# EAGLE design OpenExtruderPCB (EAGLE 9.5.2)
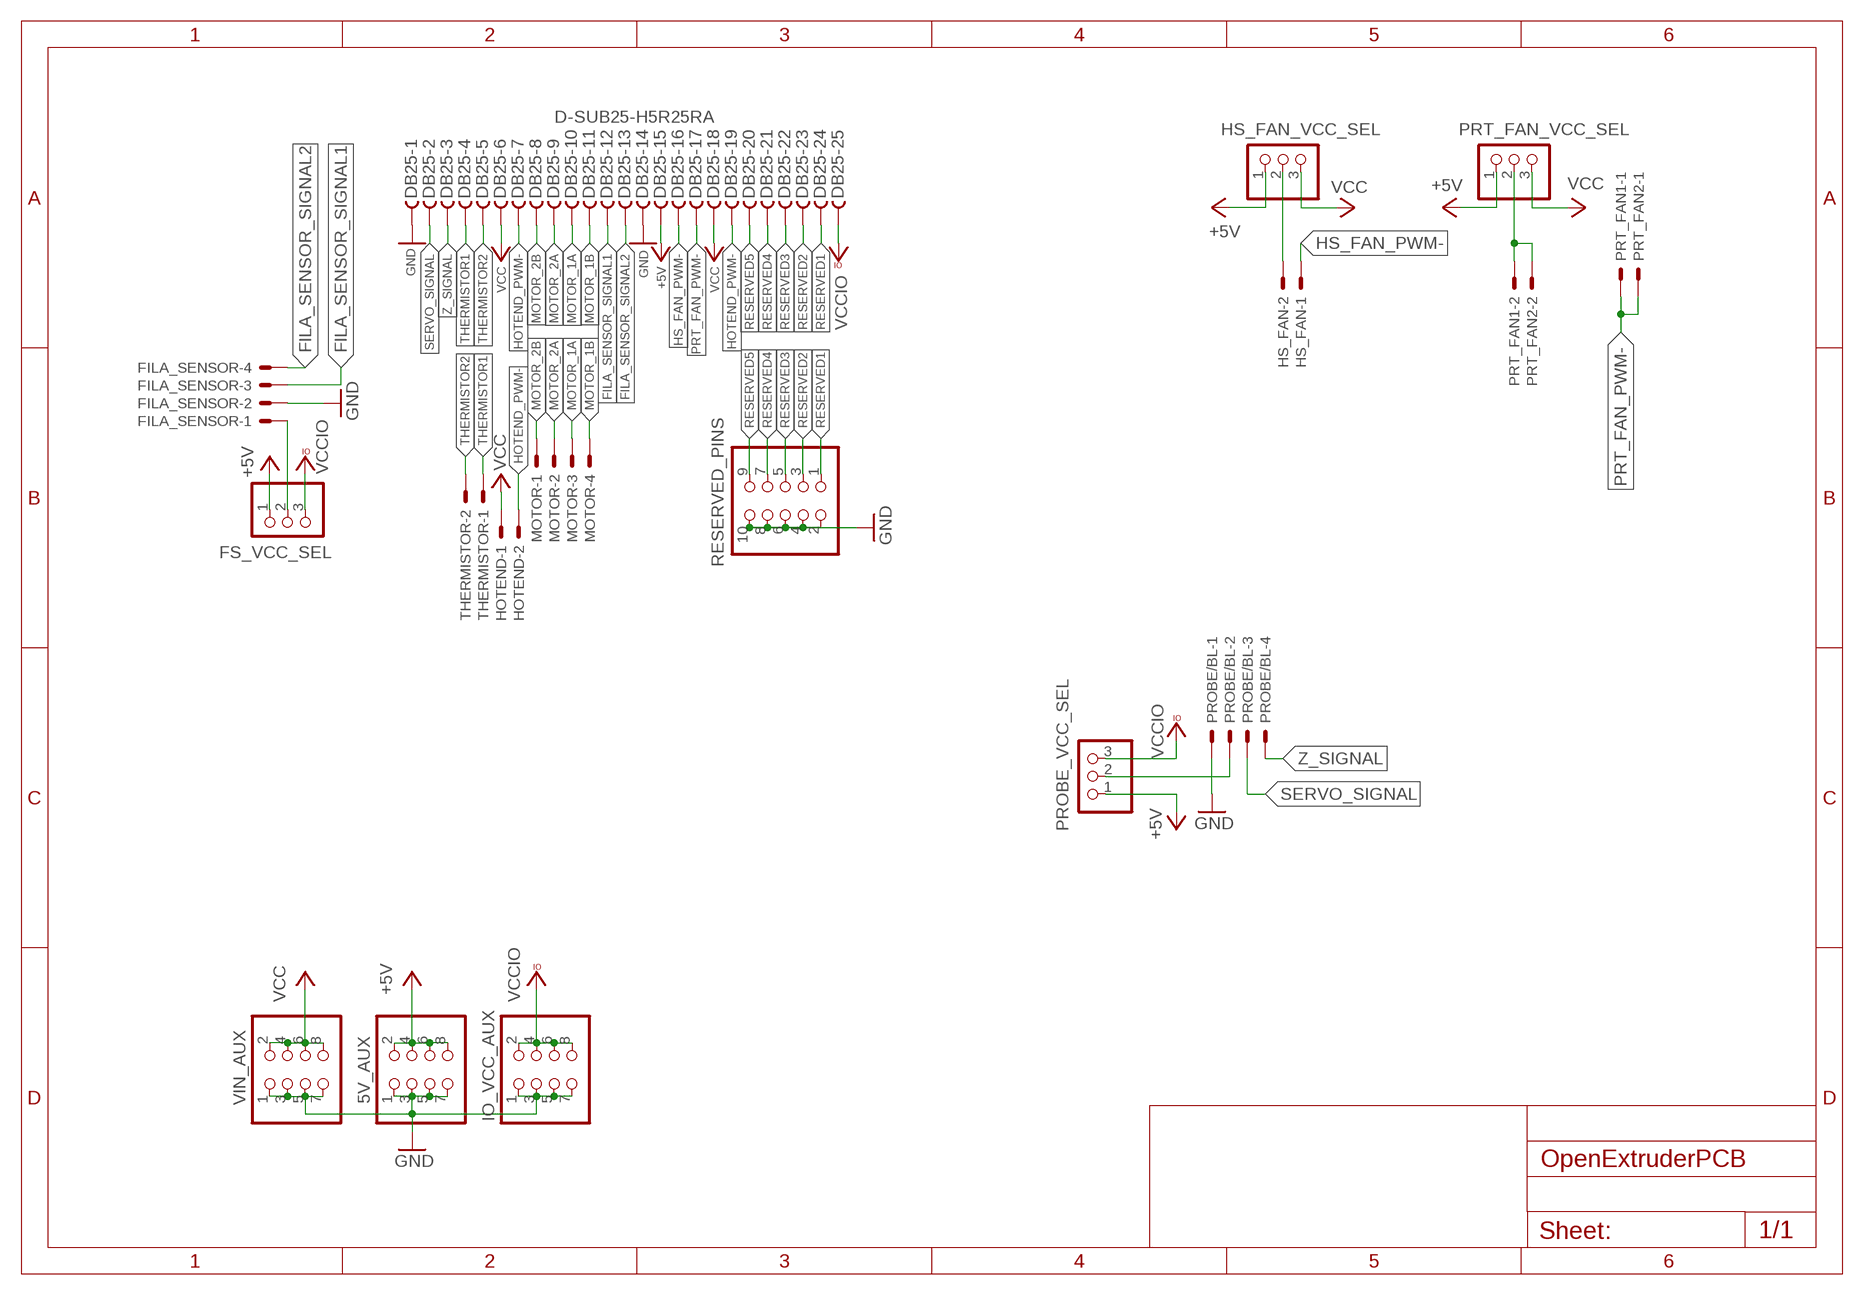
[diagram p0: schematic, sheet 1]

## Parts
5V_AUX  PINHD-2X4M  [2X04M]
DB25  D-SUB25-H5R25RA  [H5R25RA]
FILA_SENSOR  JST-XH-04-PIN-ROUND-PAD  [JST-XH-04-PACKAGE-ROUND-PAD]
FS_VCC_SEL  PINHD-1X3  [1X03]
HOTEND  JST-XH-02-PIN-LONG-PAD  [JST-XH-02-PACKAGE-LONG-PAD]
HS_FAN  JST-XH-02-PIN-ROUND-PAD  [JST-XH-02-PACKAGE-ROUND-PAD]
HS_FAN_VCC_SEL  PINHD-1X3  [1X03]
IO_VCC_AUX  PINHD-2X4M  [2X04M]
MOTOR  JST-XH-04-PIN-LONG-PAD  [JST-XH-04-PACKAGE-LONG-PAD]
PROBE/BL  JST-XH-04-PIN-ROUND-PAD  [JST-XH-04-PACKAGE-ROUND-PAD]
PROBE_VCC_SEL  PINHD-1X3  [1X03]
PRT_FAN1  JST-XH-02-PIN-ROUND-PAD  [JST-XH-02-PACKAGE-ROUND-PAD]
PRT_FAN2  JST-XH-02-PIN-ROUND-PAD  [JST-XH-02-PACKAGE-ROUND-PAD]
PRT_FAN_VCC_SEL  PINHD-1X3  [1X03]
RESERVED_PINS  PINHD-2X5M  [2X05M]
THERMISTOR  JST-XH-02-PIN-ROUND-PAD  [JST-XH-02-PACKAGE-ROUND-PAD]
VIN_AUX  PINHD-2X4M  [2X04M]

## Nets
+5V: 5V_AUX.2 5V_AUX.4 5V_AUX.6 5V_AUX.8 DB25.15 FS_VCC_SEL.1 HS_FAN_VCC_SEL.1 PROBE_VCC_SEL.1 PRT_FAN_VCC_SEL.1
FILA_SENSOR_SIGNAL1: DB25.12 FILA_SENSOR.3
FILA_SENSOR_SIGNAL2: DB25.13 FILA_SENSOR.4
FS_VCC: FILA_SENSOR.1 FS_VCC_SEL.2
GND: 5V_AUX.1 5V_AUX.3 5V_AUX.5 5V_AUX.7 DB25.1 DB25.14 FILA_SENSOR.2 IO_VCC_AUX.1 IO_VCC_AUX.3 IO_VCC_AUX.5 IO_VCC_AUX.7 PROBE/BL.1 RESERVED_PINS.2 RESERVED_PINS.4 RESERVED_PINS.6 RESERVED_PINS.8 RESERVED_PINS.10 VIN_AUX.1 VIN_AUX.3 VIN_AUX.5 VIN_AUX.7
HOTEND_PWM-: DB25.7 DB25.19 HOTEND.2
HS_FAN_PWM-: DB25.16 HS_FAN.1
HS_FAN_VCC: HS_FAN.2 HS_FAN_VCC_SEL.2
MOTOR_1A: DB25.10 MOTOR.3
MOTOR_1B: DB25.11 MOTOR.4
MOTOR_2A: DB25.9 MOTOR.2
MOTOR_2B: DB25.8 MOTOR.1
PROBE_VCC: PROBE/BL.2 PROBE_VCC_SEL.2
PRT_FAN_PWM-: DB25.17 PRT_FAN1.1 PRT_FAN2.1
PRT_FAN_VCC: PRT_FAN1.2 PRT_FAN2.2 PRT_FAN_VCC_SEL.2
RESERVED1: DB25.24 RESERVED_PINS.1
RESERVED2: DB25.23 RESERVED_PINS.3
RESERVED3: DB25.22 RESERVED_PINS.5
RESERVED4: DB25.21 RESERVED_PINS.7
RESERVED5: DB25.20 RESERVED_PINS.9
SERVO_SIGNAL: DB25.2 PROBE/BL.3
THERMISTOR1: DB25.4 THERMISTOR.1
THERMISTOR2: DB25.5 THERMISTOR.2
VCC: DB25.6 DB25.18 HOTEND.1 HS_FAN_VCC_SEL.3 PRT_FAN_VCC_SEL.3 VIN_AUX.2 VIN_AUX.4 VIN_AUX.6 VIN_AUX.8
VCCIO: DB25.25 FS_VCC_SEL.3 IO_VCC_AUX.2 IO_VCC_AUX.4 IO_VCC_AUX.6 IO_VCC_AUX.8 PROBE_VCC_SEL.3
Z_SIGNAL: DB25.3 PROBE/BL.4

## Library data of the parts
5V_AUX IO_VCC_AUX VIN_AUX = pinhead:PINHD-2X4: PIN HEADER
DB25 = con-thomas-betts:D-SUB25-: D-Subminiatur Connector Source: Electronioc Interconnects European Edition 1998; MPN: H5R25RA29CS; OC_FARNELL: unknown; OC_NEWARK: 93F8340
FILA_SENSOR MOTOR PROBE/BL = Rembrandt Electronics - JST XH Connectors v1-0:JST-XH-04-PIN: JST XH Connector 2 Pin Wire to board connector. Pitch: 2,54 mm, (0.100") Number of pins: 4 Created by Rembrandt Electronics www.rembrandtelectronics.com
FS_VCC_SEL HS_FAN_VCC_SEL PROBE_VCC_SEL PRT_FAN_VCC_SEL = pinhead:PINHD-1X3: PIN HEADER
HOTEND HS_FAN PRT_FAN1 PRT_FAN2 THERMISTOR = Rembrandt Electronics - JST XH Connectors v1-0:JST-XH-02-PIN: JST XH Connector 2 Pin Wire to board connector. Pitch: 2,54 mm, (0.100") Number of pins: 2 Created by Rembrandt Electronics www.rembrandtelectronics.com
RESERVED_PINS = pinhead:PINHD-2X5: PIN HEADER

## Board
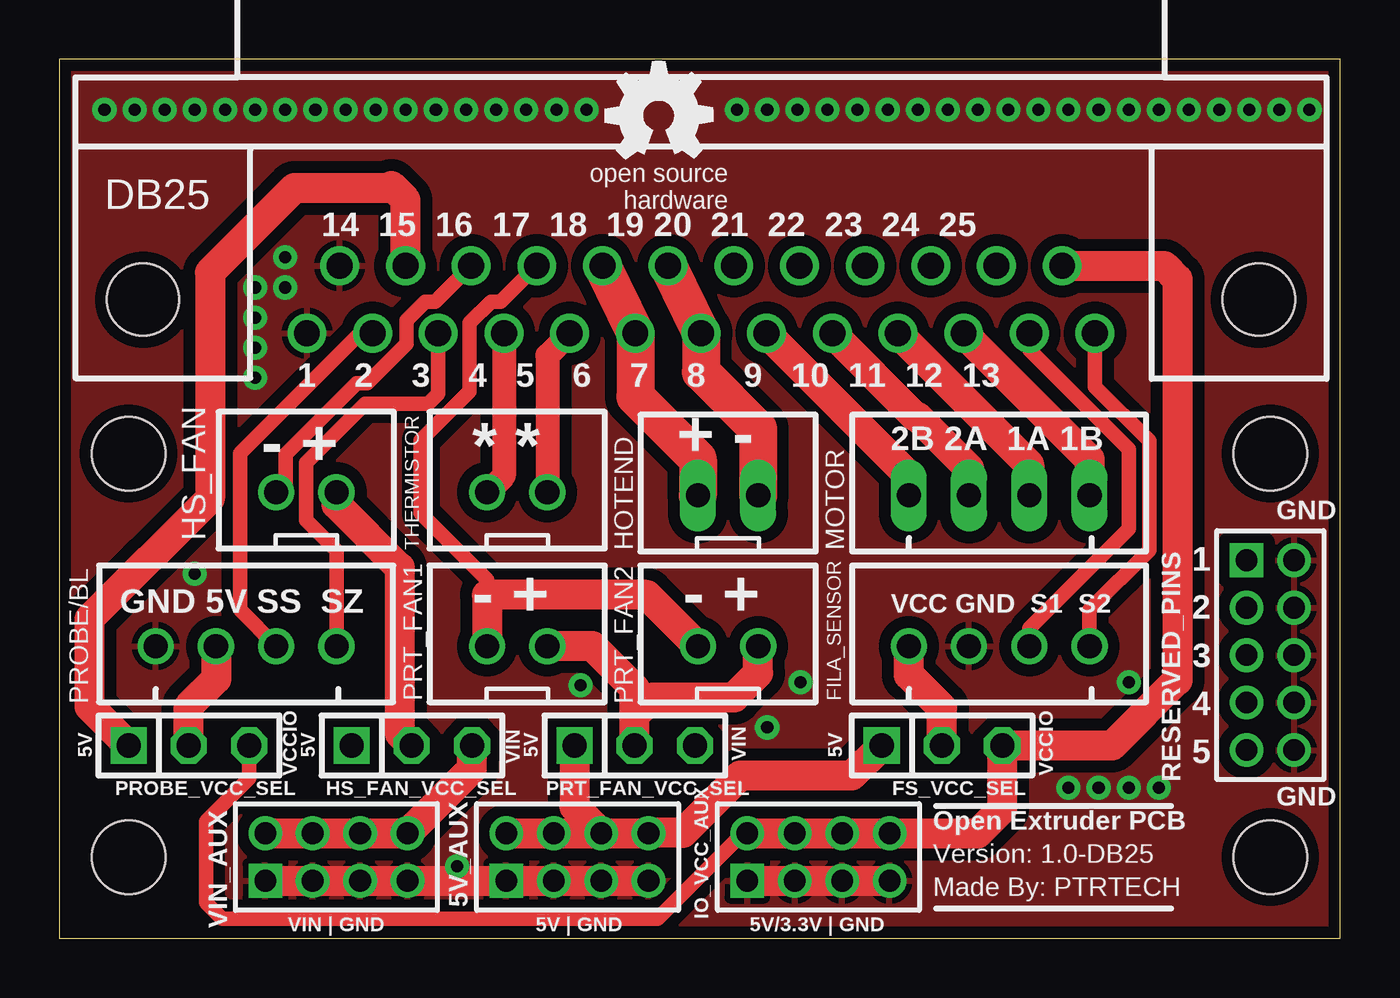
[diagram p1: board, top side]
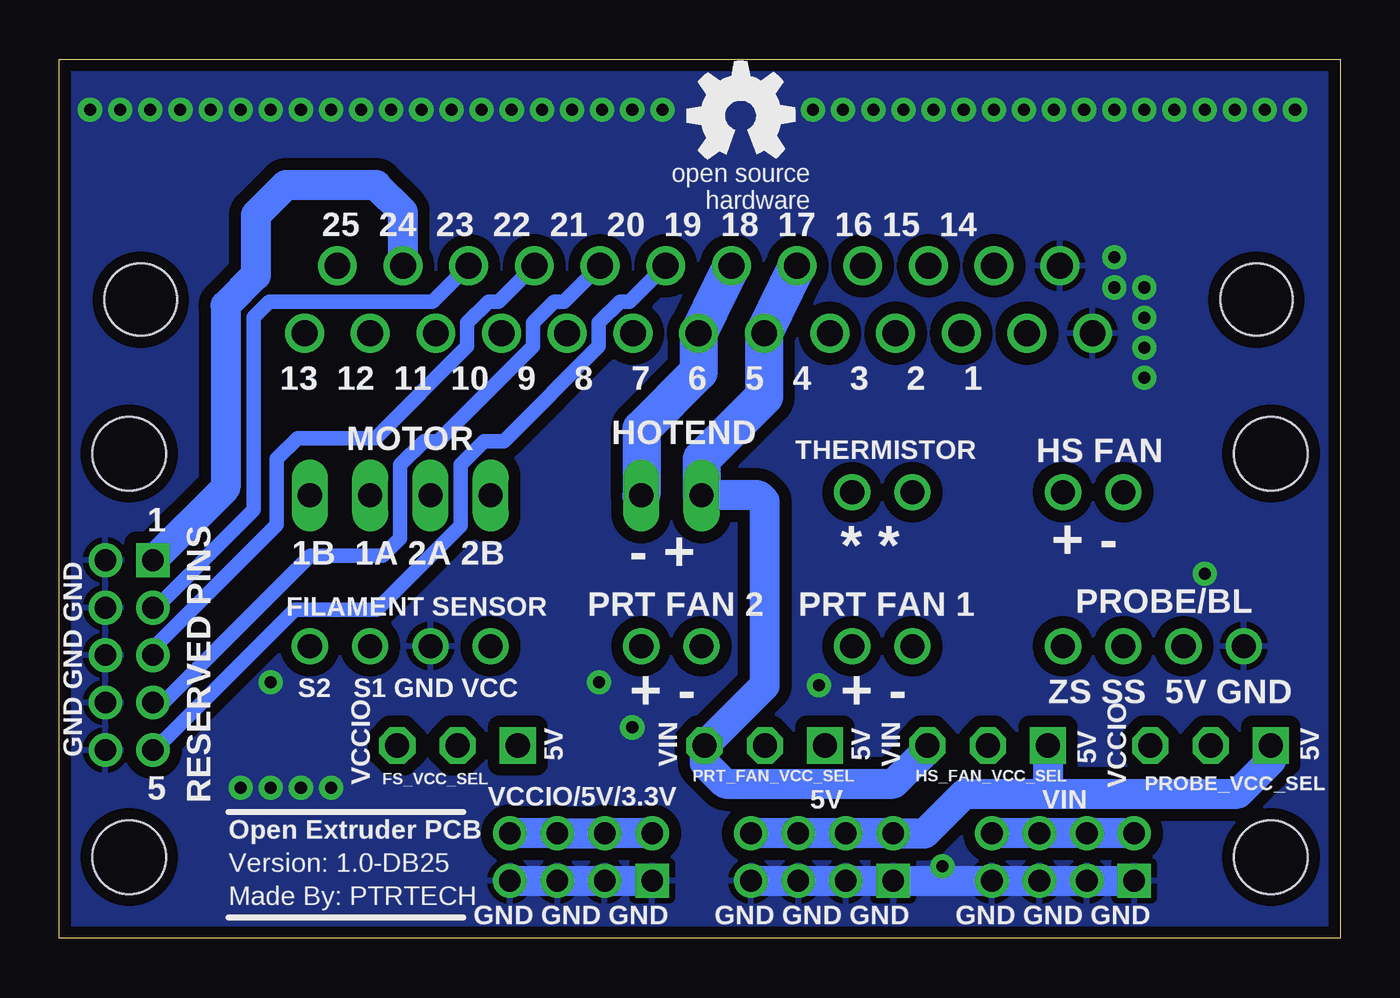
[diagram p2: board, bottom side, seen from below]

Size 54 x 37.05 mm. Coordinates in mm from the lower left corner, seen from the top.
Outline: 0,0 54,0 54,37.05 0,37.05 0,0
Copper layers (1*16): Top 0.035mm / dielectric 1.5mm / Bottom 0.035mm
Design rules "SparkFun-2-layer-STANDARD": minimum track width 10mil, minimum drill 20mil, track to track 10mil, track to pad 8mil, pad to pad 8mil, via to via 10mil, smd to smd 8mil, copper to edge 8mil, drill to drill 8mil, minimum pad ring 10mil, minimum via ring 10mil, stop-mask expansion 4mil, vias tented up to drill 25mil, thermal gap 10mil
Holes 3.1 mm at 2.92,20.43 2.92,3.43 51.05,3.43 51.05,20.43

### Footprints (pad centres in the part's own frame; a part is rotated, then mirrored left to right if it is on the bottom)
2X04M = drill 0.914 square: 1 -3,-1 | drill 0.914: 2 -3,1; 3 -1,-1; 4 -1,1; 5 1,-1; 6 1,1; 7 3,-1; 8 3,1
H5R25RA = drill 1.092: 1 16.612,1.422; 2 13.843,1.422; 3 11.074,1.422; 4 8.306,1.422; 5 5.537,1.422; 6 2.769,1.422; 7 0,1.422; 8 -2.769,1.422; 9 -5.537,1.422; 10 -8.306,1.422; 11 -11.074,1.422; 12 -13.843,1.422; 13 -16.612,1.422; 14 15.227,-1.422; 15 12.459,-1.422; 16 9.69,-1.422; 17 6.921,-1.422; 18 4.153,-1.422; 19 1.384,-1.422; 20 -1.384,-1.422; 21 -4.153,-1.422; 22 -6.921,-1.422; 23 -9.69,-1.422; 24 -12.459,-1.422; 25 -15.227,-1.422 | hole 3.048: -23.52,0; 23.52,0
JST-XH-04-PACKAGE-ROUND-PAD = drill 1.016: 1 -3.81,0; 2 -1.27,0; 3 1.27,0; 4 3.81,0
1X03 = drill 1.016 square: 1 -2.54,0 | drill 1.016 octagon: 2 0,0; 3 2.54,0
JST-XH-02-PACKAGE-LONG-PAD = drill 1.016 long: 1 -1.27,0; 2 1.27,0
JST-XH-02-PACKAGE-ROUND-PAD = drill 1.016: 1 -1.27,0; 2 1.27,0
JST-XH-04-PACKAGE-LONG-PAD = drill 1.016 long: 1 -3.81,0; 2 -1.27,0; 3 1.27,0; 4 3.81,0
2X05M = drill 0.914 square: 1 -4,-1 | drill 0.914: 2 -4,1; 3 -2,-1; 4 -2,1; 5 0,-1; 6 0,1; 7 2,-1; 8 2,1; 9 4,-1; 10 4,1

### Placement (x,y rotation side)
5V_AUX  21.84,3.43 0 top
DB25  27.05,26.92 180 top
FILA_SENSOR  39.62,12.32 0 top
FS_VCC_SEL  37.21,8.13 0 top
HOTEND  28.19,18.67 0 top
HS_FAN  10.41,18.8 0 top
HS_FAN_VCC_SEL  14.86,8.13 0 top
IO_VCC_AUX  32,3.43 0 top
MOTOR  39.62,18.67 0 top
PROBE/BL  7.87,12.32 0 top
PROBE_VCC_SEL  5.46,8.13 0 top
PRT_FAN1  19.3,12.32 0 top
PRT_FAN2  28.19,12.32 0 top
PRT_FAN_VCC_SEL  24.26,8.13 0 top
RESERVED_PINS  51.05,11.94 270 top
THERMISTOR  19.3,18.8 0 top
U$1  [OSHW_5MM]  25.27,34.67 0 bottom
U$7  [OSHW_5MM]  25.27,34.67 0 top
U$8  [OSHW_5MM]  86.61,4.57 0 bottom  (outside the outline)
VIN_AUX  11.68,3.43 0 top

### Tracks (layer width: path | path; a pad name or v marks a point on that pad's centre or on a via)
+5V
  Top 1.27: 5V_AUX.2 5V_AUX.4 5V_AUX.6 | PRT_FAN_VCC_SEL.1 21.72,5.56 5V_AUX.6 | 5V_AUX.6 5V_AUX.8 24.86,4.45 26.29,4.45 28.7,6.86 33.4,6.86 FS_VCC_SEL.1 | PROBE_VCC_SEL.1 1.27,9.78 1.27,13.46 6.35,18.54 6.35,28.07 9.91,31.62 13.91,31.62 14.01,31.71 14.59,31.13 DB25.15
  Bottom 1.27: 5V_AUX.8 5V_AUX.6 5V_AUX.4 5V_AUX.2 17.51,4.43 15.83,6.11 12.7,6.11 | PROBE_VCC_SEL.1 2.92,7.49 4.31,6.11 12.7,6.11 | HS_FAN_VCC_SEL.1 12.32,6.49 12.7,6.11
FILA_SENSOR_SIGNAL1
  Top 0.61: DB25.12 40.89,24.8 45.09,20.61 45.09,17.25 40.89,13.06 FILA_SENSOR.3
FILA_SENSOR_SIGNAL2
  Top 0.61: DB25.13 43.66,23.25 45.95,20.97 45.95,16.36 43.43,13.84 FILA_SENSOR.4
FS_VCC
  Top 1.27: FS_VCC_SEL.2 37.21,9.71 35.81,11.11 FILA_SENSOR.1
GND  (via drill 0.51)
  Top 1.27: VIN_AUX.1 VIN_AUX.3 VIN_AUX.5 VIN_AUX.7 5V_AUX.1 5V_AUX.3 5V_AUX.5 5V_AUX.7 | IO_VCC_AUX.1 IO_VCC_AUX.3 IO_VCC_AUX.5 IO_VCC_AUX.7
  Bottom 1.27: IO_VCC_AUX.7 IO_VCC_AUX.5 IO_VCC_AUX.3 IO_VCC_AUX.1 | 5V_AUX.7 5V_AUX.5 5V_AUX.3 5V_AUX.1 VIN_AUX.7 VIN_AUX.5 VIN_AUX.3 VIN_AUX.1
  other vias: 16.76,3.05 42.55,6.35 43.81,6.35 45.09,6.35 46.35,6.35 29.84,8.89 1.91,34.92 3.17,34.92 4.45,34.92 5.71,34.92 6.99,34.92 8.26,34.92 10.79,34.92 9.53,34.92 12.06,34.92 13.34,34.92 20.95,34.92 22.23,34.92 29.84,34.92 28.57,34.92 31.11,34.92 32.38,34.92 40.01,34.92 41.27,34.92 42.55,34.92 43.81,34.92 45.09,34.92 46.35,34.92 48.9,34.92 47.62,34.92 50.16,34.92 51.44,34.92 5.71,15.37 9.53,27.43 8.26,27.43 8.26,26.16 8.26,24.89 8.26,23.62 9.53,28.7 21.97,10.67 31.24,10.79 45.09,10.79 14.61,34.92 17.14,34.92 15.88,34.92 18.41,34.92 19.68,34.92 33.66,34.92 34.92,34.92 36.2,34.92 37.47,34.92 38.73,34.92 52.7,34.92
  pour Top (isolate 0.5, rank 6): -1.27,38.23 54.61,38.23 54.61,-1.27 -1.27,-1.27
  pour Bottom (isolate 0.5, rank 6): -2.54,39.5 55.88,39.5 55.88,-3.81 -2.54,-3.81
HOTEND_PWM-
  Top 1.6: DB25.19 DB25.7 27.05,23.88 29.46,21.46 HOTEND.2
  Bottom 1.6: DB25.19 DB25.7 27.05,23.88 29.46,21.46 HOTEND.2
HS_FAN_PWM-
  Top 0.61: HS_FAN.1 9.55,19.2 9.55,20.41 12.54,23.39 12.98,23.39 14.65,25.07 14.65,26.05 15.43,26.83 15.84,26.83 DB25.16
HS_FAN_VCC
  Top 1.27: HS_FAN_VCC_SEL.2 14.35,8.64 14.35,15.62 11.68,18.29 HS_FAN.2
MOTOR_1A
  Top 1.27: DB25.10 40.89,19.96 MOTOR.3
MOTOR_1B
  Top 1.27: DB25.11 43.43,20.19 MOTOR.4
MOTOR_2A
  Top 1.27: DB25.9 36.12,21.97 36.19,21.97 38.35,19.81 MOTOR.2
MOTOR_2B
  Top 1.27: DB25.8 35.81,19.51 MOTOR.1
PROBE_VCC
  Top 1.27: PROBE_VCC_SEL.2 5.46,9.78 6.62,10.94 6.62,12.3 PROBE/BL.2
PRT_FAN_PWM-
  Top 0.61: DB25.17 18.61,26.83 18.2,26.83 17.3,25.94 17.3,23.07 15.24,21 15.24,17.91 18.03,15.11 PRT_FAN1.1
  Top 1.27: PRT_FAN1.1 18.03,14.48 24.77,14.48 PRT_FAN2.1
PRT_FAN_VCC
  Top 1.27: PRT_FAN_VCC_SEL.2 24.26,9.4 | 24.26,9.4 24.26,10.54 22.48,12.32 PRT_FAN1.2 | 24.26,9.4 25.02,10.16 28.45,10.16 29.46,11.18 PRT_FAN2.2
RESERVED1
  Bottom 1.27: DB25.24 39.51,30.62 40.64,31.75 44.45,31.75 45.72,30.48 45.72,27.94 46.99,26.67 46.99,19 RESERVED_PINS.1
RESERVED2
  Bottom 0.61: DB25.23 38.26,26.83 45.14,26.83 45.8,26.18 45.8,18.05 49.91,13.94 RESERVED_PINS.3
RESERVED3
  Bottom 0.61: DB25.22 35.49,26.83 35.91,26.83 36.8,25.94 36.8,24.95 40.67,21.08 43.96,21.08 44.83,20.21 44.83,17.44 50.05,12.21 RESERVED_PINS.5
RESERVED4
  Bottom 0.61: RESERVED_PINS.7 49.61,9.94 43.42,16.13 40.37,16.13 39.62,16.87 39.62,19.96 38.63,20.95 38.03,20.95 34.03,24.95 34.03,25.94 33.14,26.83 32.72,26.83 DB25.21
RESERVED5
  Bottom 0.61: DB25.20 29.95,26.83 30.37,26.83 31.26,25.94 31.26,24.95 35.26,20.95 36.09,20.95 37.08,19.96 37.08,17.38 40.62,13.84 44.09,13.84 49.99,7.94 RESERVED_PINS.9
SERVO_SIGNAL
  Top 0.61: DB25.2 12.68,25.5 7.62,20.45 7.62,13.84 PROBE/BL.3
THERMISTOR1
  Top 1.016: DB25.4 18.75,19.51 THERMISTOR.1
THERMISTOR2
  Top 1.016: DB25.5 20.57,24.56 THERMISTOR.2
VCC
  Top 1.27: VIN_AUX.2 VIN_AUX.4 VIN_AUX.6 VIN_AUX.8 17.4,7.14 HS_FAN_VCC_SEL.3
  Top 1.6: DB25.18 DB25.6 24.28,22.84 26.92,20.19 HOTEND.1
  Bottom 1.27: VIN_AUX.2 VIN_AUX.4 VIN_AUX.6 VIN_AUX.8 | HS_FAN_VCC_SEL.3 17.4,7.96 18.83,6.53 25.94,6.53 26.8,7.39 PRT_FAN_VCC_SEL.3 24.26,10.67 24.26,18.41 24.51,18.67 HOTEND.1
  Bottom 1.6: DB25.18 DB25.6 24.28,22.84 26.92,20.19 HOTEND.1
VCCIO
  Top 0.61: IO_VCC_AUX.2 28.82,4.43 25.22,0.83 6.87,0.83 6.2,1.51 6.2,4.93 8,6.74 PROBE_VCC_SEL.3
  Top 1.27: IO_VCC_AUX.2 IO_VCC_AUX.4 IO_VCC_AUX.6 IO_VCC_AUX.8 38.72,4.43 39.75,5.46 FS_VCC_SEL.3 44.39,8.13 47.14,10.88 47.14,27.79 46.58,28.35 DB25.25
  Bottom 1.27: IO_VCC_AUX.2 IO_VCC_AUX.4 IO_VCC_AUX.6 IO_VCC_AUX.8
Z_SIGNAL
  Top 0.61: PROBE/BL.4 11.68,16.35 10.41,17.62 10.41,20.05 12.89,22.53 15.54,22.53 15.98,22.96 DB25.3

### Text on the board
tPlace: 14 15 16 17 18 19 20 21 22 23 24 25 | 1 2 3 4 5 6 7 8 9 10 11 12 13 | 2B 2A 1A 1B | - + | * * | + - | GND | GND 5V SS SZ | - + | - + | VCC GND S1 S2 | 5V | 5V | 5V | 5V | VCCIO | VIN | VIN | VCCIO | 1 / 2 / 3 / 4 / 5 | GND | VIN | GND | 5V | GND | 5V/3.3V | GND
bPlace: 25 24 23 22 21 20 19 18 17 16 15 14 | 13 12 11 10 9 8 7 6 5 4 3 2 1 | HOTEND | MOTOR | HS FAN | THERMISTOR | RESERVED PINS | 1 | + - | * * | 1B 1A 2A 2B | GND GND GND | - + | PROBE/BL | PRT FAN 1 | PRT FAN 2 | FILAMENT SENSOR | ZS SS 5V GND | + - | + - | S2 S1 GND VCC | 5V | 5V | HS_FAN_VCC_SEL | VIN | 5V | PRT_FAN_VCC_SEL | VIN | 5V | PROBE_VCC_SEL | VCCIO | VCCIO/5V/3.3V | FS_VCC_SEL | VCCIO | 5 | VIN | 5V | GND GND GND | GND GND GND | GND GND GND